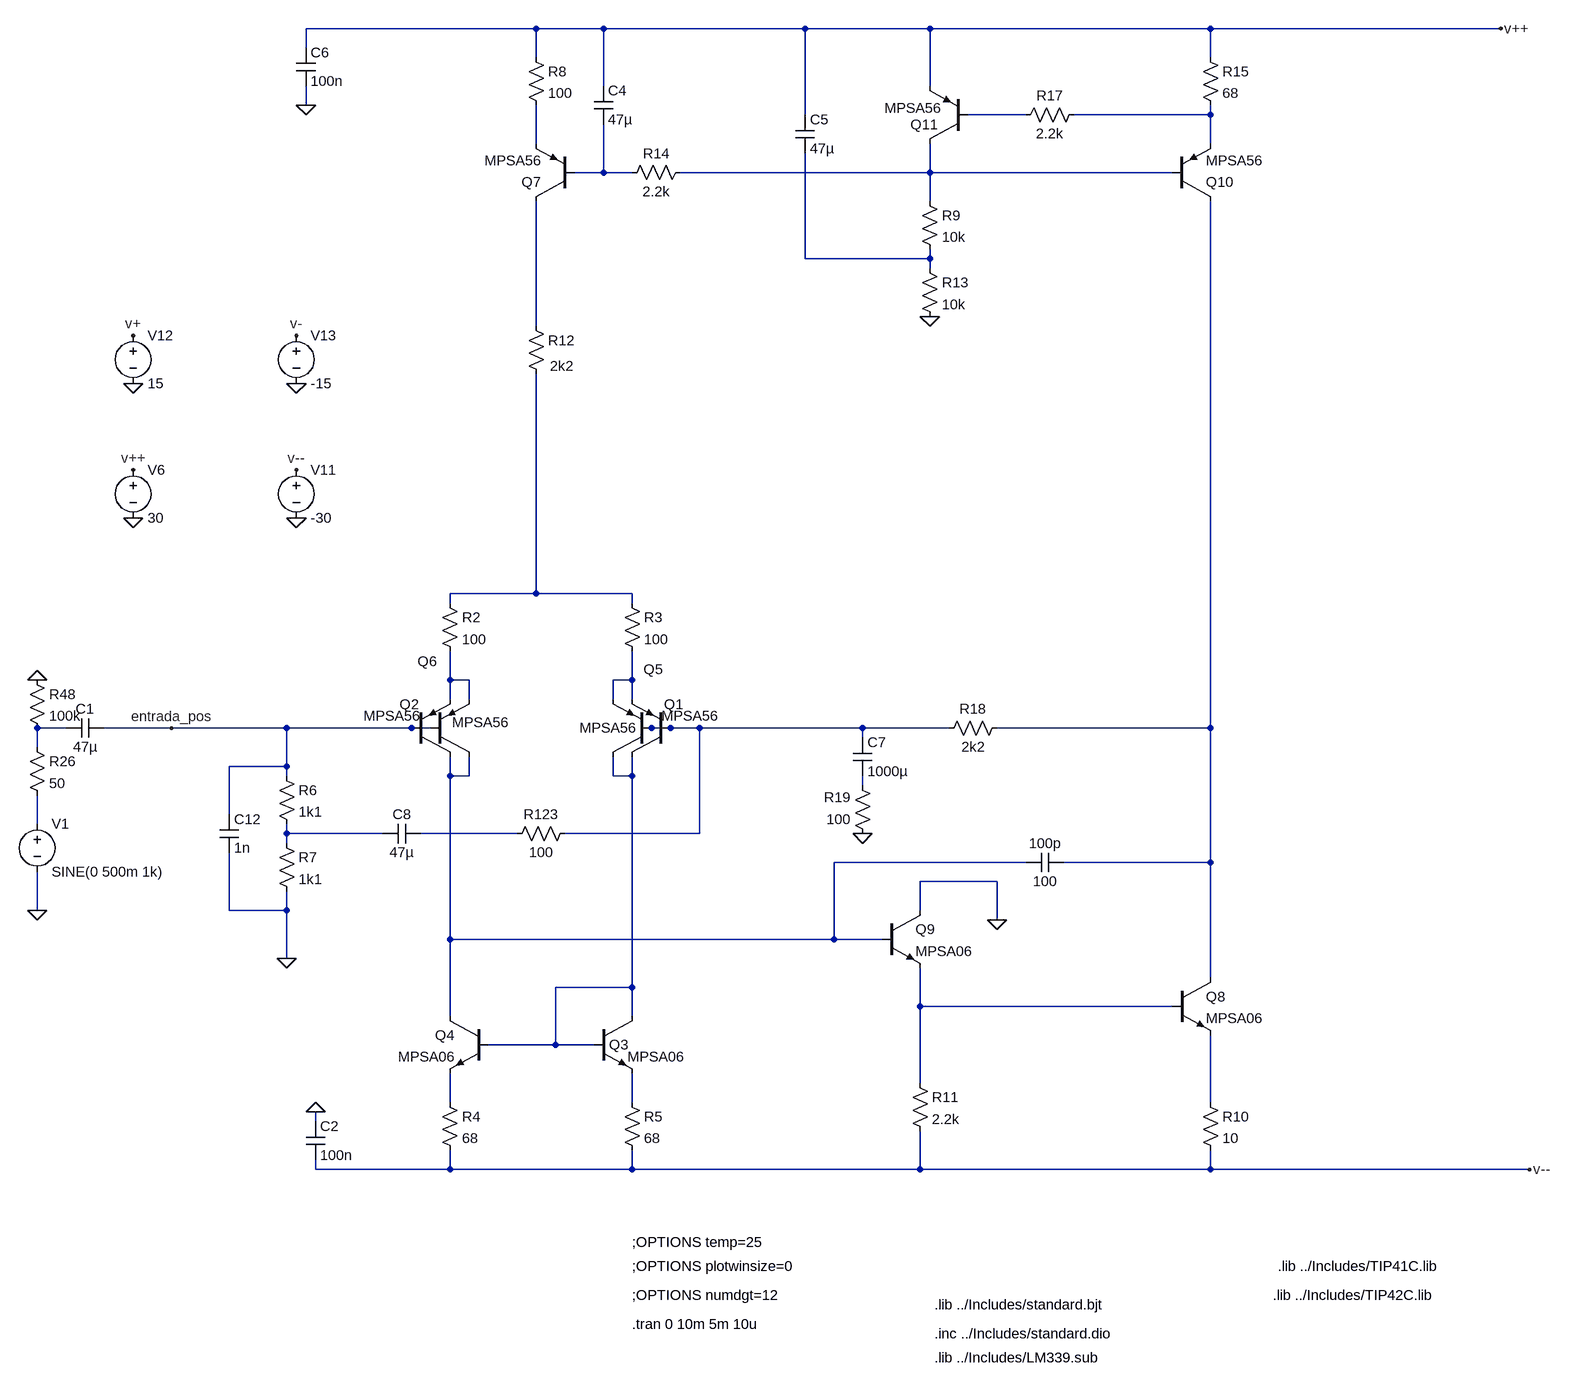
[diagram p0: schematic douglasSape.asc]
douglasSape.asc, the LTspice schematic file:
Version 4
SHEET 1 5124 1544
WIRE 480 -1824 96 -1824
WIRE 592 -1824 480 -1824
WIRE 928 -1824 592 -1824
WIRE 1136 -1824 928 -1824
WIRE 1664 -1824 1136 -1824
WIRE 3568 -1824 1664 -1824
WIRE 96 -1792 96 -1824
WIRE 480 -1776 480 -1824
WIRE 1664 -1776 1664 -1824
WIRE 592 -1728 592 -1824
WIRE 1136 -1728 1136 -1824
WIRE 96 -1696 96 -1728
WIRE 928 -1680 928 -1824
WIRE 1296 -1680 1200 -1680
WIRE 1664 -1680 1664 -1696
WIRE 1664 -1680 1376 -1680
WIRE 480 -1632 480 -1696
WIRE 1664 -1632 1664 -1680
WIRE 592 -1584 592 -1664
WIRE 592 -1584 544 -1584
WIRE 640 -1584 592 -1584
WIRE 1136 -1584 1136 -1632
WIRE 1136 -1584 720 -1584
WIRE 1600 -1584 1136 -1584
WIRE 1136 -1536 1136 -1584
WIRE 928 -1440 928 -1616
WIRE 1136 -1440 1136 -1456
WIRE 1136 -1440 928 -1440
WIRE 1136 -1424 1136 -1440
WIRE 480 -1328 480 -1536
WIRE 480 -800 480 -1248
WIRE 480 -800 336 -800
WIRE 640 -800 480 -800
WIRE 336 -784 336 -800
WIRE 640 -784 640 -800
WIRE 336 -656 336 -704
WIRE 368 -656 336 -656
WIRE 640 -656 640 -704
WIRE 640 -656 608 -656
WIRE 336 -624 336 -656
WIRE 368 -624 368 -656
WIRE 608 -624 608 -656
WIRE 640 -624 640 -656
WIRE -304 -576 -352 -576
WIRE -128 -576 -240 -576
WIRE 64 -576 -128 -576
WIRE 272 -576 64 -576
WIRE 304 -576 272 -576
WIRE 672 -576 656 -576
WIRE 704 -576 672 -576
WIRE 752 -576 704 -576
WIRE 1024 -576 752 -576
WIRE 1168 -576 1024 -576
WIRE 1664 -576 1664 -1536
WIRE 1664 -576 1248 -576
WIRE 1024 -560 1024 -576
WIRE -352 -544 -352 -576
WIRE 64 -512 64 -576
WIRE 64 -512 -32 -512
WIRE 64 -496 64 -512
WIRE 336 -496 336 -528
WIRE 368 -496 368 -528
WIRE 368 -496 336 -496
WIRE 608 -496 608 -528
WIRE 640 -496 640 -528
WIRE 640 -496 608 -496
WIRE 1024 -480 1024 -496
WIRE -32 -432 -32 -512
WIRE -352 -416 -352 -464
WIRE 64 -400 64 -416
WIRE 224 -400 64 -400
WIRE 448 -400 288 -400
WIRE 752 -400 752 -576
WIRE 752 -400 528 -400
WIRE 64 -384 64 -400
WIRE 1296 -352 976 -352
WIRE 1664 -352 1664 -576
WIRE 1664 -352 1360 -352
WIRE 1248 -320 1120 -320
WIRE -352 -272 -352 -336
WIRE -32 -272 -32 -368
WIRE 64 -272 64 -304
WIRE 64 -272 -32 -272
WIRE 1120 -272 1120 -320
WIRE 1248 -256 1248 -320
WIRE 336 -224 336 -496
WIRE 976 -224 976 -352
WIRE 976 -224 336 -224
WIRE 1056 -224 976 -224
WIRE 64 -192 64 -272
WIRE 1664 -160 1664 -352
WIRE 640 -144 640 -496
WIRE 640 -144 512 -144
WIRE 1120 -112 1120 -176
WIRE 1600 -112 1120 -112
WIRE 336 -96 336 -224
WIRE 640 -96 640 -144
WIRE 512 -48 512 -144
WIRE 512 -48 400 -48
WIRE 576 -48 512 -48
WIRE 1120 16 1120 -112
WIRE 336 48 336 0
WIRE 640 48 640 0
WIRE 1664 48 1664 -64
WIRE 112 80 112 64
WIRE 112 160 112 144
WIRE 336 160 336 128
WIRE 336 160 112 160
WIRE 640 160 640 128
WIRE 640 160 336 160
WIRE 1120 160 1120 96
WIRE 1120 160 640 160
WIRE 1664 160 1664 128
WIRE 1664 160 1120 160
WIRE 3616 160 1664 160
FLAG 64 -192 0
FLAG -352 -272 0
FLAG -128 -576 entrada_pos
FLAG 112 64 0
FLAG 1136 -1344 0
FLAG 96 -1696 0
FLAG 1248 -256 0
FLAG 1024 -400 0
FLAG 80 -1232 0
FLAG -192 -1232 0
FLAG -192 -1008 0
FLAG 80 -1008 0
FLAG -192 -1088 v++
FLAG 80 -1088 v--
FLAG 80 -1312 v-
FLAG -192 -1312 v+
FLAG 3568 -1824 v++
FLAG 3616 160 v--
FLAG -352 -656 0
SYMBOL pnp 704 -528 R180
WINDOW 0 -21 87 Left 2
WINDOW 3 -79 68 Left 2
SYMATTR InstName Q1
SYMATTR Value MPSA56
SYMBOL pnp 272 -528 M180
WINDOW 0 -20 87 Left 2
WINDOW 3 -80 68 Left 2
SYMATTR InstName Q2
SYMATTR Value MPSA56
SYMBOL npn 576 -96 R0
WINDOW 0 25 48 Left 2
SYMATTR InstName Q3
SYMATTR Value MPSA06
SYMBOL npn 400 -96 M0
SYMATTR InstName Q4
SYMATTR Value MPSA06
SYMBOL res 320 -800 R0
SYMATTR InstName R2
SYMATTR Value 100
SYMBOL res 624 -800 R0
SYMATTR InstName R3
SYMATTR Value 100
SYMBOL res 320 32 R0
SYMATTR InstName R4
SYMATTR Value 68
SYMBOL res 624 32 R0
SYMATTR InstName R5
SYMATTR Value 68
SYMBOL cap 96 80 R0
SYMATTR InstName C2
SYMATTR Value 100n
SYMBOL pnp 672 -528 R180
WINDOW 0 -19 146 Left 2
WINDOW 3 25 48 Left 2
SYMATTR InstName Q5
SYMATTR Value MPSA56
SYMBOL pnp 304 -528 M180
WINDOW 0 -22 159 Left 2
WINDOW 3 36 57 Left 2
SYMATTR InstName Q6
SYMATTR Value MPSA56
SYMBOL res 464 -1792 R0
SYMATTR InstName R8
SYMATTR Value 100
SYMBOL pnp 544 -1536 R180
SYMATTR InstName Q7
SYMATTR Value MPSA56
SYMBOL res 1120 -1552 R0
SYMATTR InstName R9
SYMATTR Value 10k
SYMBOL res 464 -1344 R0
WINDOW 3 39 83 Left 2
SYMATTR Value 2k2
SYMATTR InstName R12
SYMBOL cap 576 -1728 R0
SYMATTR InstName C4
SYMATTR Value 47µ
SYMBOL res 1120 -1440 R0
SYMATTR InstName R13
SYMATTR Value 10k
SYMBOL cap 912 -1680 R0
SYMATTR InstName C5
SYMATTR Value 47µ
SYMBOL cap 80 -1792 R0
SYMATTR InstName C6
SYMATTR Value 100n
SYMBOL res 736 -1600 R90
WINDOW 0 0 56 VBottom 2
WINDOW 3 32 56 VTop 2
SYMATTR InstName R14
SYMATTR Value 2.2k
SYMBOL res 1648 32 R0
SYMATTR InstName R10
SYMATTR Value 10
SYMBOL npn 1600 -160 R0
SYMATTR InstName Q8
SYMATTR Value MPSA06
SYMBOL npn 1056 -272 R0
SYMATTR InstName Q9
SYMATTR Value MPSA06
SYMBOL res 1104 0 R0
SYMATTR InstName R11
SYMATTR Value 2.2k
SYMBOL res 1648 -1792 R0
SYMATTR InstName R15
SYMATTR Value 68
SYMBOL pnp 1600 -1536 M180
SYMATTR InstName Q10
SYMATTR Value MPSA56
SYMBOL pnp 1200 -1632 R180
WINDOW 0 50 32 Left 2
WINDOW 3 45 59 Left 2
SYMATTR InstName Q11
SYMATTR Value MPSA56
SYMBOL res 1392 -1696 R90
WINDOW 0 0 56 VBottom 2
WINDOW 3 32 56 VTop 2
SYMATTR InstName R17
SYMATTR Value 2.2k
SYMBOL res 1264 -592 R90
WINDOW 0 0 56 VBottom 2
WINDOW 3 32 56 VTop 2
SYMATTR InstName R18
SYMATTR Value 2k2
SYMBOL res 1040 -384 R180
WINDOW 0 36 76 Left 2
WINDOW 3 36 40 Left 2
SYMATTR InstName R19
SYMATTR Value 100
SYMBOL cap 1008 -560 R0
SYMATTR InstName C7
SYMATTR Value 1000µ
SYMBOL cap 1360 -368 R90
WINDOW 0 0 32 VBottom 2
WINDOW 3 32 32 VTop 2
SYMATTR InstName 100p
SYMATTR Value 100
SYMBOL res 48 -512 R0
SYMATTR InstName R6
SYMATTR Value 1k1
SYMBOL res 48 -400 R0
SYMATTR InstName R7
SYMATTR Value 1k1
SYMBOL cap 288 -416 R90
WINDOW 0 0 32 VBottom 2
WINDOW 3 32 32 VTop 2
SYMATTR InstName C8
SYMATTR Value 47µ
SYMBOL res 544 -416 R90
WINDOW 0 0 56 VBottom 2
WINDOW 3 32 56 VTop 2
SYMATTR InstName R123
SYMATTR Value 100
SYMBOL voltage -192 -1104 R0
WINDOW 123 0 0 Left 0
WINDOW 39 0 0 Left 0
SYMATTR InstName V6
SYMATTR Value 30
SYMBOL voltage 80 -1104 R0
WINDOW 123 0 0 Left 0
WINDOW 39 0 0 Left 0
SYMATTR InstName V11
SYMATTR Value -30
SYMBOL voltage -192 -1328 R0
WINDOW 123 0 0 Left 0
WINDOW 39 0 0 Left 0
SYMATTR InstName V12
SYMATTR Value 15
SYMBOL voltage 80 -1328 R0
WINDOW 123 0 0 Left 0
WINDOW 39 0 0 Left 0
SYMATTR InstName V13
SYMATTR Value -15
SYMBOL cap -48 -432 R0
SYMATTR InstName C12
SYMATTR Value 1n
SYMBOL cap -240 -592 R90
WINDOW 0 0 32 VBottom 2
WINDOW 3 32 32 VTop 2
SYMATTR InstName C1
SYMATTR Value 47µ
SYMBOL res -368 -560 R0
SYMATTR InstName R26
SYMATTR Value 50
SYMBOL voltage -352 -432 R0
WINDOW 123 0 0 Left 0
WINDOW 39 0 0 Left 0
SYMATTR InstName V1
SYMATTR Value SINE(0 500m 1k)
SYMBOL res -368 -672 R0
SYMATTR InstName R48
SYMATTR Value 100k
TEXT 1144 464 Left 2 !.lib ../Includes/standard.bjt
TEXT 640 496 Left 2 !.tran 0 10m 5m 10u
TEXT 1144 512 Left 2 !.inc ../Includes/standard.dio
TEXT 640 400 Left 2 !;OPTIONS plotwinsize=0
TEXT 640 448 Left 2 !;OPTIONS numdgt=12
TEXT 640 360 Left 2 !;OPTIONS temp=25
TEXT 1144 552 Left 2 !.lib ../Includes/LM339.sub
TEXT 1776 400 Left 2 !.lib ../Includes/TIP41C.lib
TEXT 1768 448 Left 2 !.lib ../Includes/TIP42C.lib

The netlist it stands for:
* douglasSape.asc
Q1 N015 N012 N010 0 MPSA56
Q2 N014 entrada_pos N009 0 MPSA56
Q3 N015 N015 N022 0 MPSA06
Q4 N014 N015 N021 0 MPSA06
R2 N008 N009 100
R3 N008 N010 100
R4 N021 v-- 68
R5 N022 v-- 68
C2 0 v-- 100n
Q5 N015 N012 N010 0 MPSA56
Q6 N014 entrada_pos N009 0 MPSA56
R8 v++ N003 100
Q7 N007 N004 N003 0 MPSA56
R9 N005 N006 10k
R12 N007 N008 2k2
C4 v++ N004 47µ
R13 N006 0 10k
C5 v++ N006 47µ
C6 v++ 0 100n
R14 N005 N004 2.2k
R10 N023 v-- 10
Q8 N013 N020 N023 0 MPSA06
Q9 0 N014 N020 0 MPSA06
R11 N020 v-- 2.2k
R15 v++ N002 68
Q10 N013 N005 N002 0 MPSA56
Q11 N005 N001 v++ 0 MPSA56
R17 N002 N001 2.2k
R18 N013 N012 2k2
R19 0 N016 100
C7 N012 N016 1000µ
C§100p N013 N014 100
R6 entrada_pos N018 1k1
R7 N018 0 1k1
C8 N019 N018 47µ
R123 N012 N019 100
V6 v++ 0 30
V11 v-- 0 -30
V12 v+ 0 15
V13 v- 0 -15
C12 entrada_pos 0 1n
C1 entrada_pos N011 47µ
R26 N011 N017 50
V1 N017 0 SINE(0 500m 1k)
R48 0 N011 100k
.model NPN NPN
.model PNP PNP
.lib standard.bjt
.lib ../Includes/standard.bjt
.tran 0 10m 5m 10u
.inc ../Includes/standard.dio
;OPTIONS plotwinsize=0
;OPTIONS numdgt=12
;OPTIONS temp=25
.lib ../Includes/LM339.sub
.lib ../Includes/TIP41C.lib
.lib ../Includes/TIP42C.lib
.backanno
.end